# Altium project grove-emg sensor v1.PrjPcb
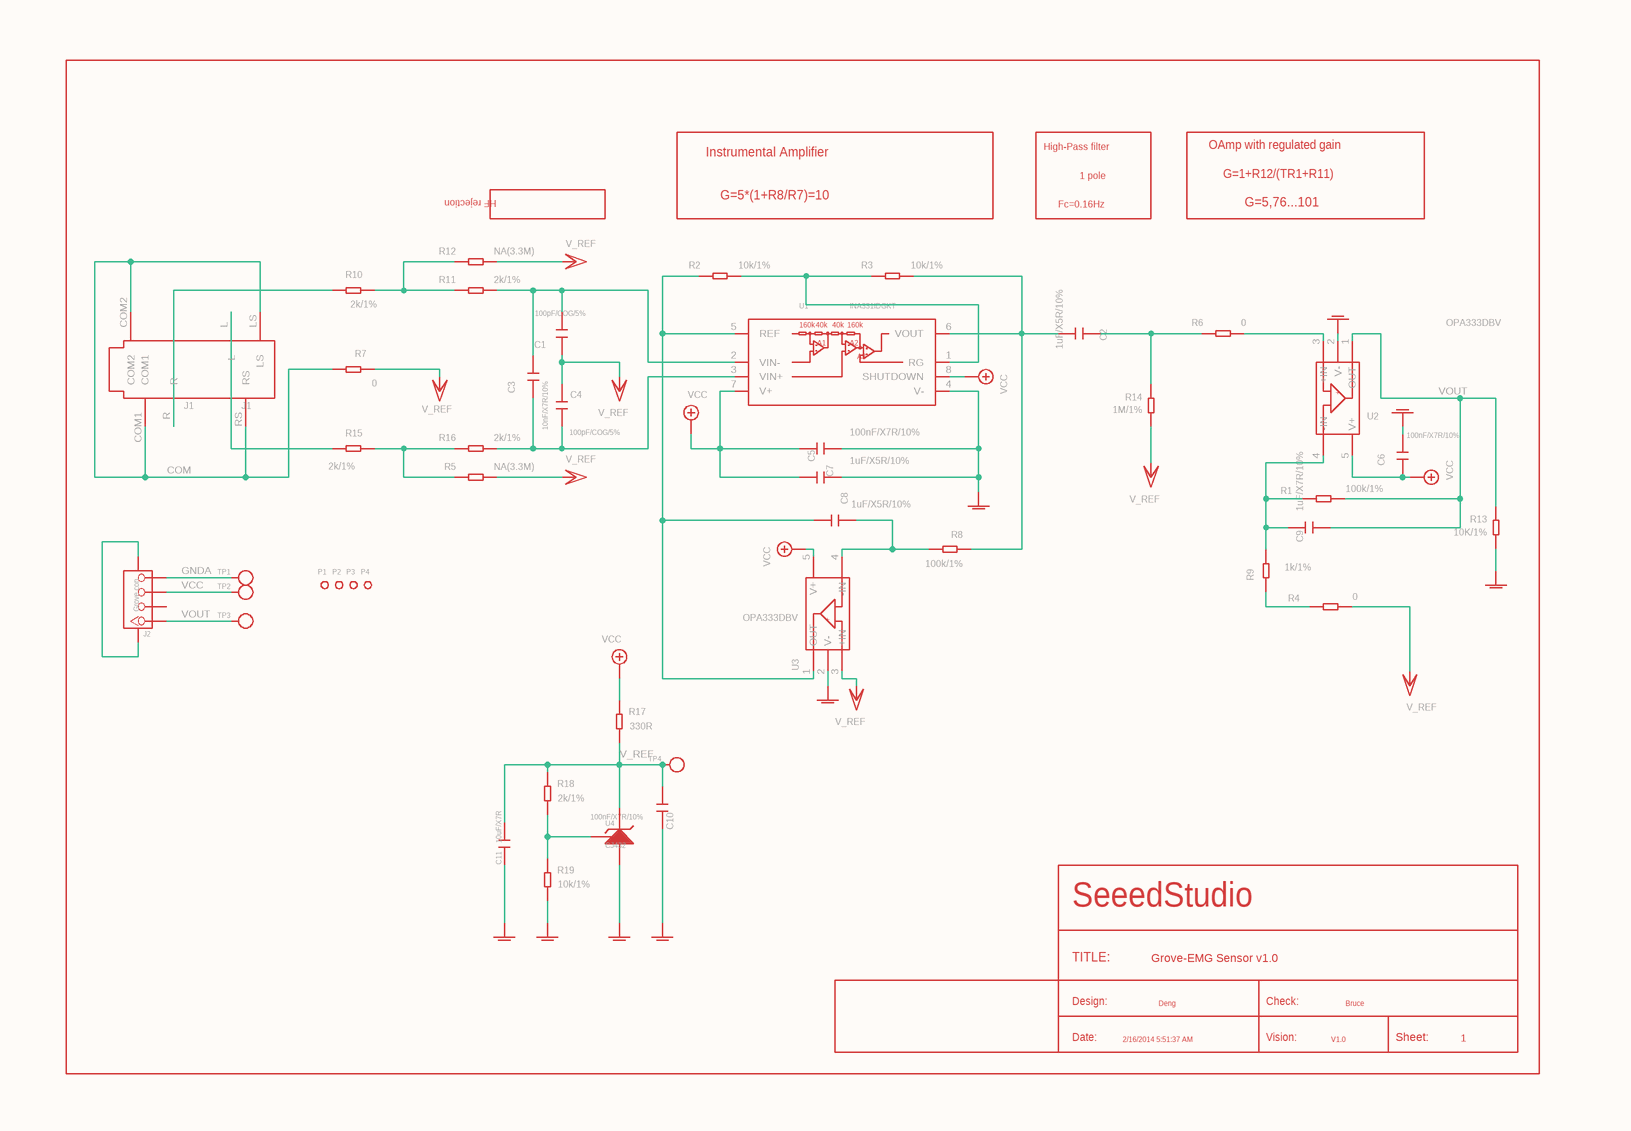
[diagram p0: Grove-EMG Sensor v1.0.SchDoc]
1 sheet, 65 parts. Net scope: global (net labels, ports and power ports of the same name join across sheets).
Board file: Grove-EMG Sensor v1.0.PcbDoc

## Sheet Grove-EMG Sensor v1.0.SchDoc: Grove-EMG Sensor v1.0
size 286 x 197 mm; Date: 2/16/2014 5:51:37 AM; SheetNumber: 1; Origin: Eagle; GateName_1: G$1; SymbolName_1: SEEEDSTUDIO_SCH_FRAME; LibraryName: moudle; DeviceSetName: SEEEDSTUDIO_SCH_FRAME; Sheet: Sheet:; SeeedStudio: SeeedStudio; Design: Design:; Check: Check:; Vision: Vision:

### Parts
C1  100pF/COG/5%  [C0603]
C2  1uF/X5R/10%  [C0603]
C3  10nF/X7R/10%  [C0603]
C4  100pF/COG/5%  [C0603]
C5  100nF/X7R/10%  [C0603]
C6  100nF/X7R/10%  [C0603]
C7  1uF/X5R/10%  [C0603]
C8  1uF/X5R/10%  [C0603]
C9  1uF/X7R/10%  [C0603]
C10  100nF/X7R/10%  [C0603]
C11  10uF/X7R  [C0805]
GND1  GNDA  (value not drawn)
GND2  GNDA  (value not drawn)
GND3  GNDA  (value not drawn)
GND4  GNDA  (value not drawn)
GND7  GNDA  (value not drawn)
GND9  GNDA  (value not drawn)
GND10  GNDA  (value not drawn)
GND11  GNDA  (value not drawn)
GND14  GNDA  (value not drawn)
J1  J1  [6P-SMD-3.5-NEW]
J2  Grove con  [4P-SMD-2.0]
P1  PAD-MARK  [ROUND-MARK-1.0]  (value not drawn)
P2  PAD-MARK  [ROUND-MARK-1.0]  (value not drawn)
P3  PAD-MARK  [ROUND-MARK-1.0]  (value not drawn)
P4  PAD-MARK  [ROUND-MARK-1.0]  (value not drawn)
P+1  V_REF
P+3  V_REF
P+5  V_REF
P+6  V_REF
P+7  V_REF
P+9  V_REF
P+10  V_REF
R1  100k/1%  [R0603]
R2  10k/1%  [R0603]
R3  10k/1%  [R0603]
R4  0  [R0603]
R5  NA(3.3M)  [R0603]
R6  0  [R0603]
R7  0  [R0603]
R8  100k/1%  [R0603]
R9  1k/1%  [R0603]
R10  2k/1%  [R0603]
R11  2k/1%  [R0603]
R12  NA(3.3M)  [R0603]
R13  10K/1%  [R0603]
R14  1M/1%  [R0603]
R15  2k/1%  [R0603]
R16  2k/1%  [R0603]
R17  330R  [R0603]
R18  2k/1%  [R0603]
R19  10k/1%  [R0603]
TP1  TP1  [TP_4545]  (value not drawn)
TP2  TP2  [TP_4545]  (value not drawn)
TP3  TP3  [TP_4545]  (value not drawn)
TP4  TP4  [TP_4545]  (value not drawn)
U1  INA331IDGKT  [MSOP-8]
U2  OPA333DBV  [SOT23-5]
U3  OPA333DBV  [SOT23-5]
U4  CJ432  [SOT23]
V1  VCC
V2  VCC
V4  VCC
V6  VCC
V18  VCC

### Nets
COM: J1.COM1 J1.COM2 J1.LS J1.RS R7.1
GNDA: J2.4 TP1.T
V_REF: C10.1 C11.2 R17.1 R18.2 TP4.T U4.2(K)
VCC: J2.3 TP2.T
VOUT: C9.2 J2.1 R1.2 R13.1 TP3.T U2.1(OUT)
NetC1_1: C1.1 C4.2 P+3.?1(VCC/2)
NetC1_2: C1.2 C3.2 R11.1 U1.2(VIN-)
NetC2_1: C2.1 R3.1 R8.2 U1.6(VOUT)
NetC2_2: C2.2 R6.2 R14.1
NetC3_1: C3.1 C4.1 R16.1 U1.3(VIN+)
NetC5_1: C5.1 C7.1 U1.7(V+) V18.?1(+5V)
NetC5_2: C5.2 C7.2 GND7.?1(GNDA) U1.4(V-)
NetC6_1: C6.1 GND4.?1(GNDA)
NetC6_2: C6.2 U2.5(V+) V1.?1(+5V)
NetC8_1: C8.1 R8.1 U3.4(-IN)
NetC8_2: C8.2 R2.2 U1.5(REF) U3.1(OUT)
NetC9_1: C9.1 R1.1 R9.1 U2.4(-IN)
NetC10_2: C10.2 GND11.?1(GNDA)
NetC11_1: C11.1 GND14.?1(GNDA)
NetGND1_?1: GND1.?1(GNDA) U2.2(V-)
NetGND2_?1: GND2.?1(GNDA) R13.2
NetGND3_?1: GND3.?1(GNDA) U3.2(V-)
NetGND9_?1: GND9.?1(GNDA) U4.3(A)
NetGND10_?1: GND10.?1(GNDA) R19.1
NetJ1_L: J1.L R15.1
NetJ1_R: J1.R R10.1
NetJ2_SS1: J2.SS1 J2.SS2
NetP+1_?1: P+1.?1(VCC/2) R12.1
NetP+5_?1: P+5.?1(VCC/2) R14.2
NetP+6_?1: P+6.?1(VCC/2) R4.2
NetP+7_?1: P+7.?1(VCC/2) R5.1
NetP+9_?1: P+9.?1(VCC/2) U3.3(+IN)
NetP+10_?1: P+10.?1(VCC/2) R7.2
NetR2_1: R2.1 R3.2 U1.1(RG)
NetR4_1: R4.1 R9.2
NetR5_2: R5.2 R15.2 R16.2
NetR6_1: R6.1 U2.3(+IN)
NetR10_2: R10.2 R11.2 R12.2
NetR17_2: R17.2 V6.?1(+5V)
NetR18_1: R18.1 R19.2 U4.1(R)
NetU1_8: U1.8(SHUTDOWN) V4.?1(+5V)
NetU3_5: U3.5(V+) V2.?1(+5V)

Not connected (* = marked no-connect by the designer): J2 2

### Notes on the sheet
- High-Pass filter
- OAmp with regulated gain
- HF rejection
- Instrumental Amplifier
- G=5*(1+R8/R7)=10
- Fc=0.16Hz
- 1 pole
- G=1+R12/(TR1+R11)
- G=5,76...101
- SeeedStudio
- TITLE:
- Design:
- Grove-EMG Sensor v1.0
- Deng
- Check:
- Bruce
- Date:
- 2/16/2014 5:51:37 AM
- Vision:
- V1.0
- Sheet:
- 1

### Library data of the parts
C1-C10 = C*-0603: Ceramic Capacitors; GateName_1: C; DeviceName: -0603; DeviceSetName: C*; SymbolName_1: C; LibraryName: Discrete
C11 = C*-0805: Ceramic Capacitors; GateName_1: C; DeviceName: -0805; DeviceSetName: C*; SymbolName_1: C; LibraryName: Discrete
GND1-GND4 GND7 GND9-GND11 GND14 = GNDA: SUPPLY SYMBOL; GateName_1: 1; SymbolName_1: GNDA; LibraryName: supply1; DeviceSetName: GNDA
J1 = AUDIO-6P-SMD: GateName_1: G$1; SymbolName_1: AUDIO; LibraryName: Connector; DeviceSetName: AUDIO-6P-SMD
J2 = TWIG-4P-2.0-SMD-FEMALE-REINFORCE'DD': GateName_1: G$1; SymbolName_1: TWIG_2.0DD; DeviceName: 'DD'; LibraryName: Connector; DeviceSetName: TWIG-4P-2.0-SMD-FEMALE-REINFORCE
P1-P4 = PAD-MARK: PARTNO: DNP; GateName_1: G$1; SymbolName_1: MARK; LibraryName: Discrete; DeviceSetName: PAD-MARK
P+1 P+3 P+5-P+7 P+9 P+10 = VCC/2: SUPPLY SYMBOL; GateName_1: G$1; SymbolName_1: VCC/2; LibraryName: supply1; DeviceSetName: VCC/2
R1-R19 = R*-0603: GateName_1: R; DeviceName: -0603; DeviceSetName: R*; SymbolName_1: R; LibraryName: Discrete
TP1-TP4 = PAD-TEST-POINT'4545': PARTNO: DNP; GateName_1: TP; SymbolName_1: TEST_POINT; DeviceName: '4545'; LibraryName: Discrete; DeviceSetName: PAD-TEST-POINT
U1 = INA331EA: GateName_1: G$1; SymbolName_1: INA331; DeviceName: EA; LibraryName: template; DeviceSetName: INA331; A1: A1; 160k: 160k; 40k: 40k; A2: A2; A3: A3
U2 U3 = OPA333DBV: 1.8V,Micro power CMOS oprational amplifiers Zero-Drift Series  http://www.ti.com.cn/cn/lit/ds/symlink/opa333.pdf; GateName_1: G$1; SymbolName_1: OPA333; DeviceName: DBV; LibraryName: IC; DeviceSetName: OPA333; +: +; -: -
U4 = REFERENCE-SOURCE: CJ432,AZ432 or other Adjustable Reference Source; GateName_1: REFERENCE; SymbolName_1: REFERENCE-SOURCE; LibraryName: For_Test_Albert_v6; DeviceSetName: REFERENCE-SOURCE
V1 V2 V4 V6 V18 = +5V: SUPPLY SYMBOL; SymbolName_1: +05V; GateName_1: +5V; LibraryName: SUPPLY2; DeviceSetName: +5V